# EAGLE design GBC USB-C Charging Kit (EAGLE 6.2)
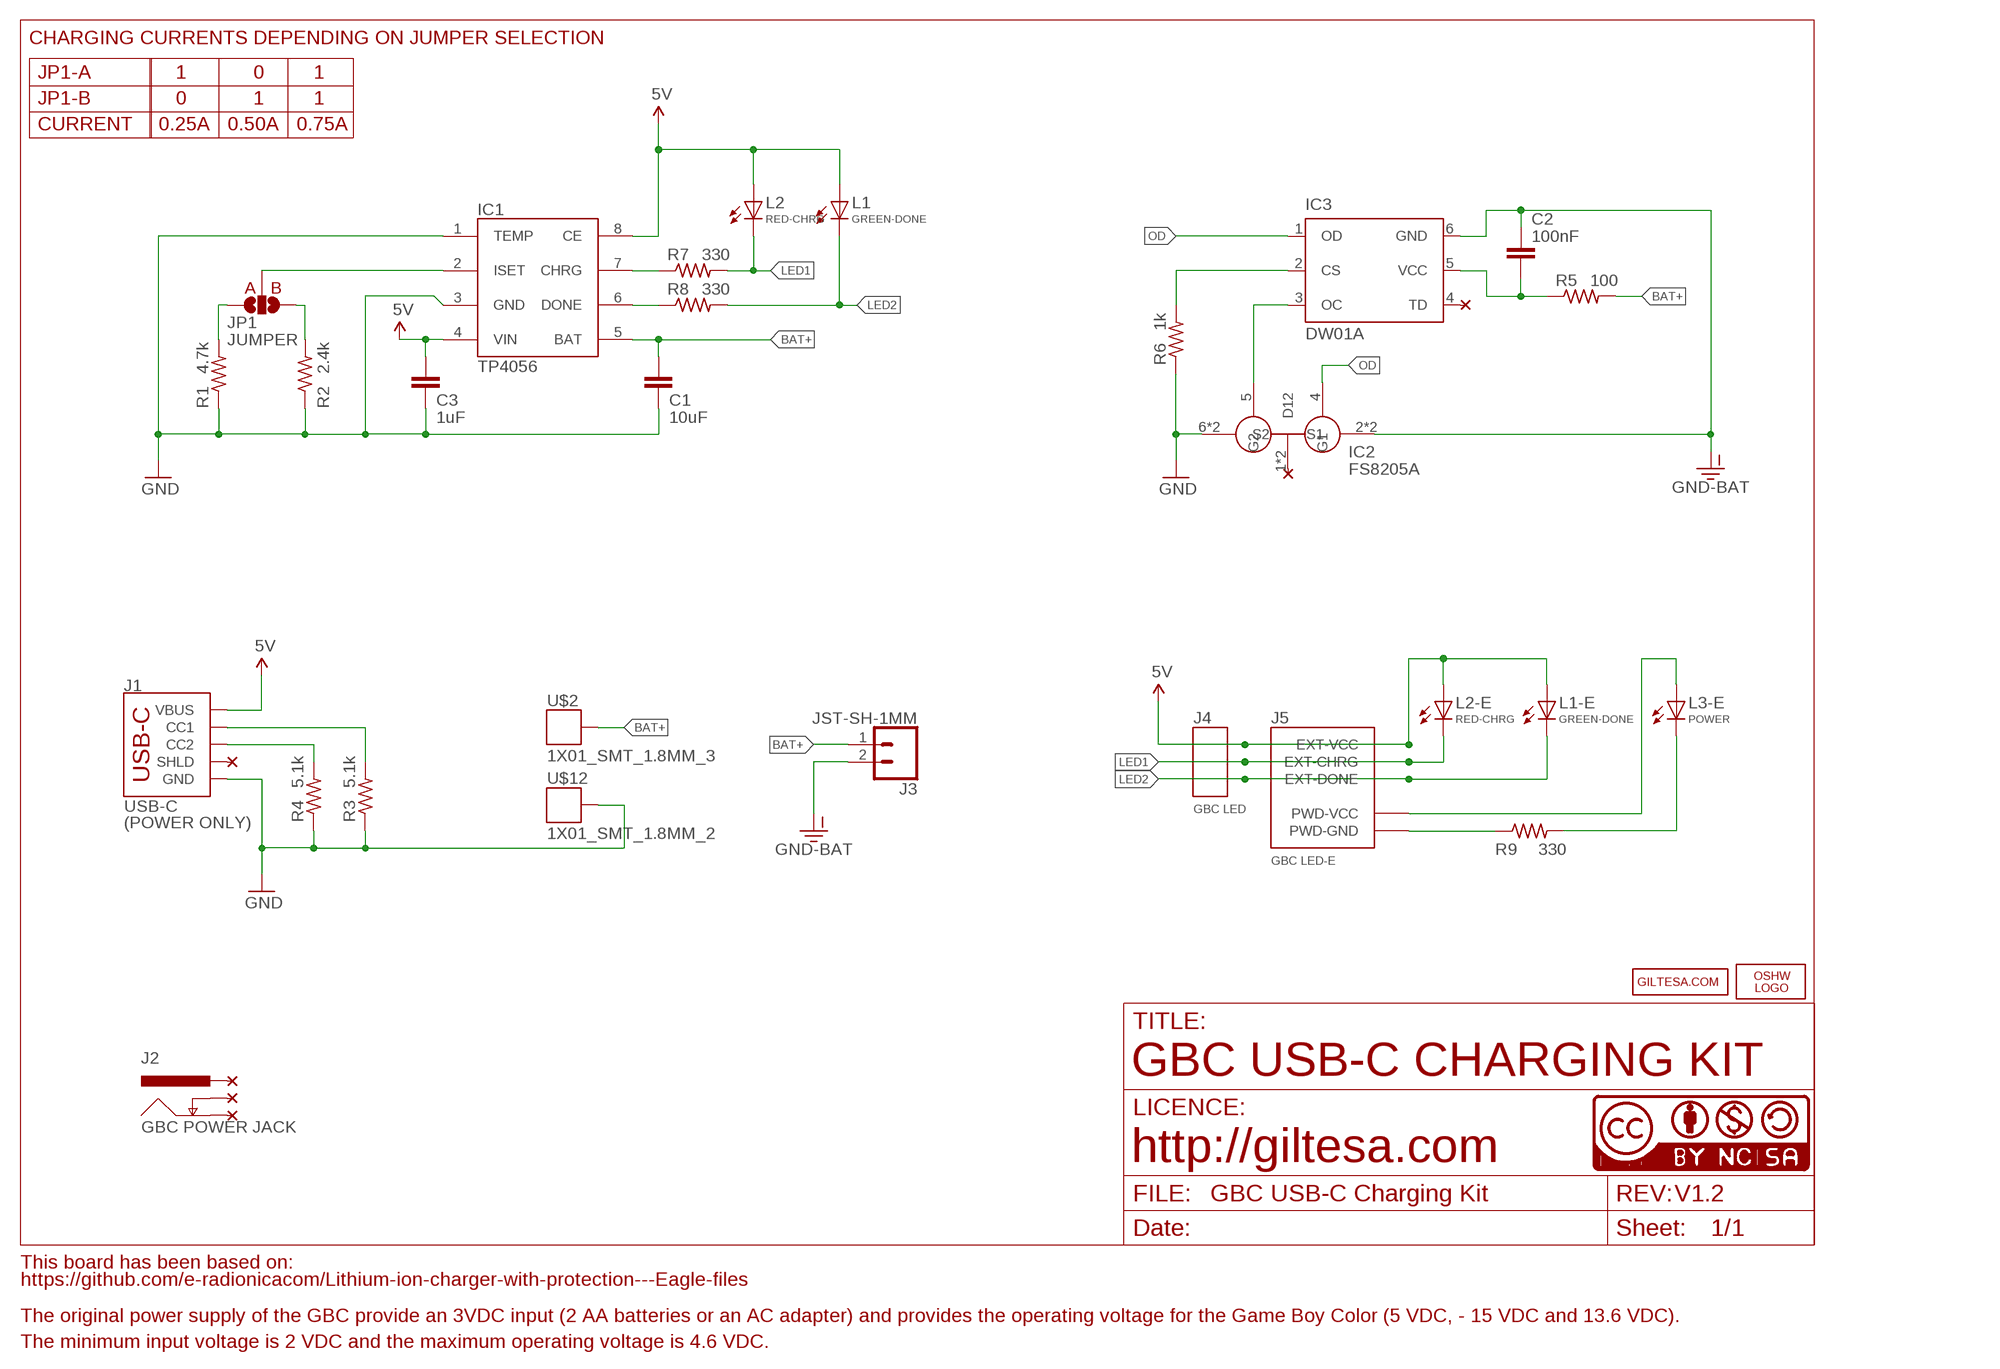
[diagram p0: schematic, sheet 1]

## Parts
C1  10uF  C1206  [C1206]
C2  100nF  C0603  [C0603]
C3  1uF  C0603  [C0603]
IC1  TP4056  DIO5158  [SOIC-8]
IC2  8205A  FS8205A  [TSSOP8]
IC3  DW01A  DW01-P  [SOT23-6L]
J1  USB-C  USB-CPOWER  [USB-C_6P]
J2  GBC POWER JACK  GBC_POWER_JACK2  [GBC_POWER_JACK_2]
J3  JST-SH-1MM  JST-21MM  [JST-2-1MM-SMD_RIGHT]
J4  GBC LED  1X032  [1X03_SMD_2]
J5  GBC LED-E  GBC_LED  [GBC_LED]
JP1  JUMPER  JUMPER-SMT_3_NO_SILK  [SMT-JUMPER_3_NO_SILK]
L1  GREEN-DONE  L0402  [L0402]
L1-E  GREEN-DONE  L0402  [L0402]
L2  RED-CHRG  L0402  [L0402]
L2-E  RED-CHRG  L0402  [L0402]
L3-E  POWER  L0402  [L0402]
LOGO1  OSHW_LOGO_FILLX0150-NT  [OSHW_FILLX150_NOTEXT]
R1  4.7k  R0402  [R0402]
R2  2.4k  R0402  [R0402]
R3  5.1k  R0402  [R0402]
R4  5.1k  R0402  [R0402]
R5  100  R0402  [R0402]
R6  1k  R0402  [R0402]
R7  330  R0402  [R0402]
R8  330  R0402  [R0402]
R9  330  R0402  [R0402]
U$2  1X01_SMT_1.8MM_3  [1X01_SMT_1.8MM_3]
U$10  GILTESA.COM_MASK  [GILTESA.COM_MASK]
U$12  1X01_SMT_1.8MM_2  [1X01_SMT_1.8MM_2]
U$17  CC-NC-BCNIX  [CC-NC-B_NIX]

## Nets
5V: C3.1 IC1.4(VIN) IC1.8(CE) J1.VBUS1(VBUS) J1.VBUS2(VBUS) J4.3 J5.EXT-VCC L1-E.A L1.A L2-E.A L2.A
BAT+: C1.1 IC1.5(BAT) J3.1 R5.2 U$2.P$1
CHRG: IC1.7(CHRG) R7.1
DONE: IC1.6(DONE) R8.1
GND: C1.2 C3.2 IC1.1(TEMP) IC1.3(GND) IC2.6(S2) IC2.7(S2) J1.GND1(GND) J1.GND2(GND) R1.1 R2.1 R3.1 R4.1 R6.1 U$12.P$1
GND-BAT: C2.1 IC2.2(S1) IC2.3(S1) IC3.6(GND) J3.2
ISET: IC1.2(ISET) JP1.2
LED1: J4.2 J5.EXT-CHRG L2-E.C L2.C R7.2
LED2: J4.1 J5.EXT-DONE L1-E.C L1.C R8.2
N$1: IC3.2(CS) R6.2
N$2: IC2.5(G2) IC3.3(OC)
N$4: J1.B5(CC2) R4.2
N$8: JP1.3 R2.2
N$9: JP1.1 R1.2
N$10: J5.PWD-VCC L3-E.A
N$11: L3-E.C R9.2
N$12: J5.PWD-GND R9.1
N$13: J1.A5(CC1) R3.2
OD: IC2.4(G1) IC3.1(OD)
VCC-DW: C2.2 IC3.5(VCC) R5.1
Unconnected: IC2.1(D12) IC2.8(D12) IC3.4(TD) J1.SHLD1(SHLD) J1.SHLD2(SHLD) J1.SHLD3(SHLD) J1.SHLD4(SHLD) J1.SHLD5(SHLD) J1.SHLD6(SHLD) J1.SHLD7(SHLD) J1.SHLD8(SHLD) J2.P$1(PWR) J2.P$2(GND) J2.P$3(GNDBREAK)

## Notes on the sheet
- CHARGING CURRENTS DEPENDING ON JUMPER SELECTION
- JP1-A | 1 | 0 | 1
- JP1-B | 0 | 1 | 1
- CURRENT | 0.25A | 0.50A | 0.75A
- A | B
- IC2
- FS8205A
- (POWER ONLY)
- GBC USB-C CHARGING KIT
- http://giltesa.com
- V1.2
- This board has been based on:
- https://github.com/e-radionicacom/Lithium-ion-charger-with-protection---Eagle-files
- The original power supply of the GBC provide an 3VDC input (2 AA batteries or an AC adapter) and provides the operating voltage for the Game Boy Color (5 VDC, - 15 VDC and 13.6 VDC).
- The minimum input voltage is 2 VDC and the maximum operating voltage is 4.6 VDC.

## Library data of the parts
C1 = ,giltesa:C1206
C2 C3 = ,giltesa:C0603
IC1 = ERADIONICA:DIO5158
IC2 = SparkFun:FS8205A
IC3 = lipo:DW01-P: One Cell Lithium-ion/Polymer Battery Protection IC The DW01-P battery protection IC is designed to protect lithium-ion/polymer battery from damage or degrading the lifetime due to overcharge, overdischarge, and/or overcurrent for one-cell lithium-ion/polymer battery powered systems, such as cellular phones. The ultra-small package and less required external components make it ideal to integrate the DW01-P into the limited space of battery pack. The accurate ±50mV overcharging detection voltage ensures safe and full utilization charging. The very low standby current drains little current from the cell while in storage.
J1 = ,giltesa:USB-C
J2 = ,giltesa:GBC_POWER_JACK
J3 = ,giltesa:JST-2
J4 = ,giltesa:1X03
J5 = ,giltesa:GBC_LED
JP1 = SparkFun-Jumpers:JUMPER-SMT_3_NO: Normally open jumper This jumper has three pads in close proximity to each other. Apply solder to close the connection(s).
L1 L1-E L2 L2-E L3-E = ,giltesa:L0402
LOGO1 = ohw-logo:OSHW_LOGO_FILL
R1-R9 = ,giltesa:R0402
U$2 U$12 = ,giltesa:1X01
U$10 = ,giltesa_logos:GILTESA.COM
U$17 = cc-by-nc-sa:CC-NC-BC: All hardware is licensed under the Creative Commons Attribution-Noncommercial-Share Alike 2.5 Switzerland License. To view a copy of this license, visit http://creativecommons.org/licenses/by-nc-sa/2.5/ch/ or send a letter to Creative Commons, 171 Second Street, Suite 300, San Francisco, California, 94105, USA.

## Net classes
1 power: width 0.61 mm, drill 0.406 mm, clearance 0.203 mm
2 gnd: width 0.305 mm, drill 0.406 mm, clearance 0.203 mm
3 power usb: width 0.508 mm, drill 0.406 mm, clearance 0.203 mm

## Board
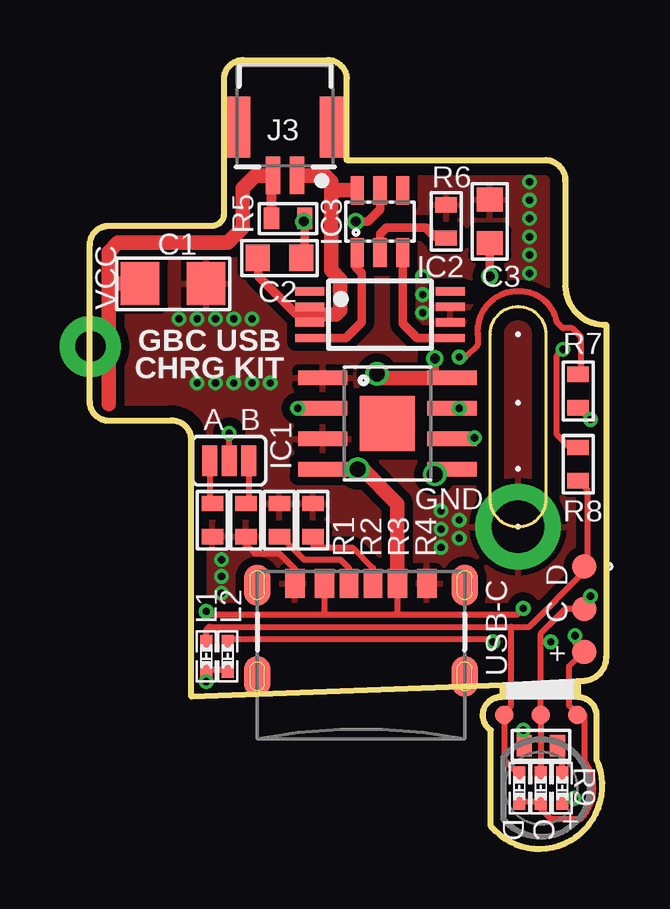
[diagram p1: board, top side]
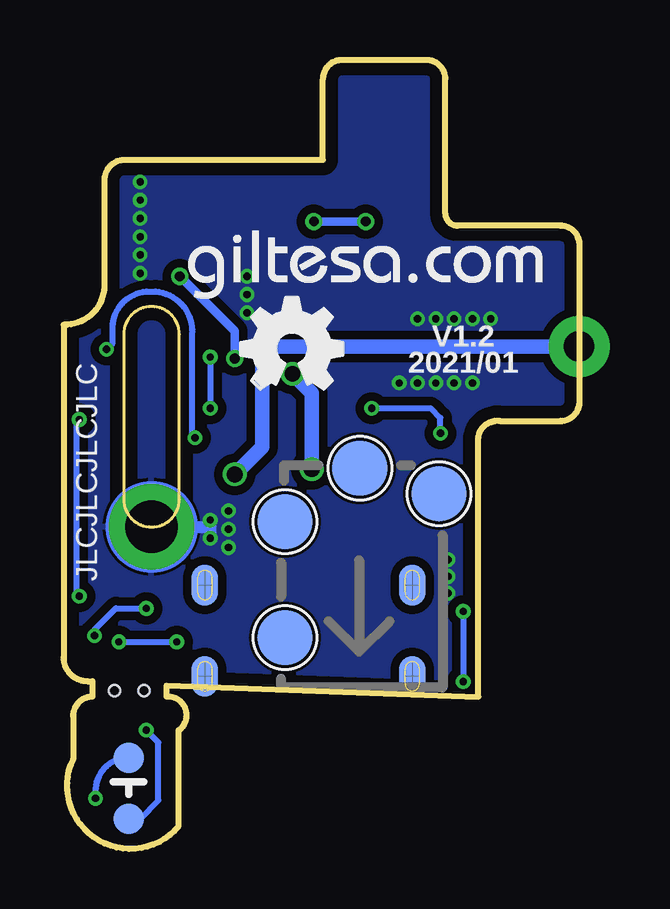
[diagram p2: board, bottom side, seen from below]

Size 21.51 x 32.89 mm. Coordinates in mm from the lower left corner, seen from the top.
Outline: 19,21.45 19,14.57 arc-180 16.69,14.57 16.69,21.45 arc-180 19,21.45
Outline: 4.23,6.34 4.23,17.14 arc90 3.33,17.84 0.8,17.84 arc-90 0,18.64 0,25.17 arc-90 0.8,25.97 5.09,25.97 arc90 5.59,26.47 5.59,32.09 arc-90 6.39,32.89 9.9,32.89 arc-90 10.71,32.09 10.71,28.72 19.01,28.72 arc-90 19.81,27.82 19.81,23.45 arc90 21.51,21.85 21.51,7.99 arc-90 20.51,6.99 20.31,6.99 20.31,6.34 arc-90 21.11,5.54 21.11,3.74 arc-165 16.71,0.94 16.71,4.94 arc-149 17.21,6.34 17.21,6.81 4.23,6.34
Copper layers (1*16): Top 0.035mm / dielectric 1.6mm / Bottom 0.035mm
Design rules: minimum track width 6mil, minimum drill 12mil, track to track 6mil, track to pad 6mil, pad to pad 6mil, via to via 8mil, smd to smd 0mil, copper to edge 20mil, drill to drill 10mil, minimum pad ring 6mil, minimum via ring 6mil, stop-mask expansion 0mil, vias tented up to drill 100mil, thermal gap 10mil
Holes 0.46 mm at 18.16,6.59 19.38,6.59

### Footprints (pad centres in the part's own frame; a part is rotated, then mirrored left to right if it is on the bottom)
C1206 = smd 1.6 x 1.8: 1 -1.362,0; 2 1.387,0
C0603 = smd 1 x 1.1: 1 -0.901,0; 2 0.901,0
SOIC-8 = smd 0.61 x 2.057: 1 -2.07,-2.892; 2 -0.8,-2.892; 3 0.47,-2.892; 4 1.74,-2.892; 5 1.74,2.492; 6 0.47,2.492; 7 -0.8,2.492; 8 -2.07,2.492 | smd 2.286 x 2.286: EPAD -0.165,-0.2
TSSOP8 = smd 1.2 x 0.35: 1 -2.925,0.975; 2 -2.925,0.325; 3 -2.925,-0.325; 4 -2.925,-0.975; 5 2.925,-0.975; 6 2.925,-0.325; 7 2.925,0.325; 8 2.925,0.975
SOT23-6L = smd 0.55 x 1.2: 1 -0.95,-1.3; 2 0,-1.3; 3 0.95,-1.3; 4 0.95,1.3; 5 0,1.3; 6 -0.95,1.3
USB-C_6P = smd 0.76 x 1.2: A5 -0.5,-0.08; B5 0.5,-0.08 | smd 0.8 x 1.2: GND1 -2.75,-0.08; GND2 2.75,-0.08; VBUS1 -1.52,-0.08; VBUS2 1.52,-0.08 | smd 1.1 x 1.7: SHLD1 -4.32,-0.15; SHLD2 4.32,-0.15; SHLD5 -4.32,-3.95; SHLD8 4.32,-3.95 | smd 1.1 x 1.7 bottom: SHLD3 -4.32,-0.15; SHLD4 4.32,-0.15; SHLD6 -4.32,-3.95; SHLD7 4.32,-3.95
GBC_POWER_JACK_2 = smd 2.286 x 2.286 bottom: P$1 5.232,10.16; P$2 8.357,7.925; P$3 1.93,9.093; P$4 8.357,3.099
JST-2-1MM-SMD_RIGHT = smd 0.6 x 1.55: 1 -0.5,-2.017; 2 0.5,-2.017 | smd 1.219 x 2.54: NC1 -2.054,0; NC2 2.054,0
1X03_SMD_2 = smd 1.016 x 1.016: 1 0,-1.778; 2 0,0; 3 0,1.778
GBC_LED = smd 0.762 x 0.762: EXT-CHRG -3.048,0; EXT-DONE -3.048,-1.524; EXT-VCC -3.048,1.524 | smd 1.27 x 1.27 bottom: PWD-GND 1.27,0; PWD-VCC -1.27,0
SMT-JUMPER_3_NO_SILK = smd 0.635 x 1.27: 1 -0.813,0; 2 0,0; 3 0.813,0
L0402 = smd 0.7 x 0.5: A -0.55,0; C 0.55,0
R0402 = smd 0.635 x 0.9: 1 -0.694,0; 2 0.694,0
1X01_SMT_1.8MM_3 = drill 1.27 pad 2.54: P$1 0,0
1X01_SMT_1.8MM_2 = drill 2.184 pad 3.556: P$1 0,0

### Placement (x,y rotation side)
C1  3.46,23.56 0 top
C2  7.91,24.63 0 top
C3  16.66,26.15 90 top
IC1  12.6,17.56 270 top
IC2  12.09,22.27 0 top
IC3  12.09,26.15 0 top
J1  11.3,11.14 0 top
J2  3.93,5.7 0 top
J3  8.14,30.09 0 top
J4  20.6,9.99 180 top
J5  18.79,2.53 270 top
JP1  5.81,16.18 0 top
L1  4.85,8.02 90 top
L1-E  17.9,2.53 90 top
L2  5.74,8.02 90 top
L2-E  18.79,2.53 90 top
L3-E  19.68,2.53 90 top
LOGO1  14.12,19.17 0 bottom
R1  5.11,13.71 90 top
R2  6.5,13.71 90 top
R3  7.9,13.71 270 top
R4  9.3,13.71 270 top
R5  8.27,26.28 180 top
R6  14.84,26.15 270 top
R7  20.35,19.08 270 top
R8  20.35,16.04 270 top
R9  18.79,4.31 0 top
U$2  0.03,20.94 0 top
U$10  16.41,22.85 0 bottom
U$12  17.85,13.43 0 top
U$17  0.41,6.34 0 top

### Tracks (layer width: path | path; a pad name or v marks a point on that pad's centre or on a via)
5V  (via drill 0.3, 0.41, 0.66)
  Top 0.254: L1-E.A L2-E.A 18.79,1.67 19.2,1.26 20.47,1.26 arc80 20.6,3.67 20.6,5.58 20.47,5.45 J5.EXT-VCC 20.32,5.61 19.97,5.96 19.97,7.61 20.57,8.21 J4.3 20.22,8.59 v20.22,8.88 | L2.A L1.A v4.85,6.97 | v4.85,9.9 4.98,9.77 9.81,9.77 | 9.81,9.77 12.73,9.77 | 12.73,9.77 17.81,9.77 v18.06,10.02 | J1.VBUS1 9.78,9.8 9.81,9.77 | J1.VBUS2 12.82,9.86 12.73,9.77
  Top 0.356: 14.8,19.63 14.38,19.67 v14.38,20.44 | v16.66,23.87 C3.1
  Top 0.61: IC1.4 v11.16,15.82 11.37,15.82 12.82,14.38 J1.VBUS2 | IC1.8 14.8,19.63 12.13,19.63 v11.96,19.8
  Bottom 0.254: v20.22,8.88 20.22,9.13 19.33,10.02 v18.06,10.02 | v4.85,9.9 v4.85,6.97
  Bottom 0.356: v14.38,20.44 14.38,21.58 v16.66,23.87
  Bottom 0.61: v11.16,15.82 11.16,19 v11.96,19.8
BAT+  (via drill 0.66)
  Top 0.406: R5.2 7.57,28 J3.1
  Top 0.61: 0.79,23.61 0.79,24.88 1.17,25.26 5.74,25.26 6.38,25.9 6.38,27.55 6.9,28.07 J3.1 | C1.1 0.84,23.56 0.79,23.61 | IC1.5 14.59,15.82 v14.38,15.61 | 0.79,23.61 0.79,20.18 | 0.79,18.53 0.79,20.18 | 0.79,20.18 U$2.P$1
  Bottom 0.61: U$2.P$1 12.85,20.94 13.23,20.56 13.23,16.75 v14.38,15.61
CHRG  (via drill 0.3)
  Top 0.254: R7.1 20.47,19.78 20.47,21.33 20.09,21.71 19.71,21.71 19.46,21.96 arc75 18.06,23.23 17.68,23.23 arc90 16.16,21.45 16.16,21.01 15.65,20.5 v15.39,20.5 | v15.39,18.37 15.39,18.31 IC1.7
  Bottom 0.254: v15.39,20.5 v15.39,18.37
DONE  (via drill 0.3)
  Top 0.254: R8.1 19.99,16.73 19.46,17.26 19.46,20.56 v19.71,20.82 | IC1.6 15.99,17.09 v16.03,17.13
  Bottom 0.254: v19.71,20.82 19.46,21.07 19.46,21.58 arc90 18.06,23.23 17.68,23.23 arc90 16.16,21.45 16.16,17.26 v16.03,17.13
GND  (via drill 0.3)
  Top 0.254: R2.1 6.5,12.69 6.89,12.31 7.9,12.31 8.55,11.66 J1.GND1
  Bottom 0.508: 17.81,13.43 15.39,13.43 v15.39,12.94
  Bottom 3.81: U$12.P$1 17.81,13.43
  other vias: 5.49,12.05 5.49,11.36 5.49,10.66 15.39,13.71 14.63,13.32 14.63,14.09 14.63,12.56 13.87,23.87 13.87,23.1 13.87,22.34 3.71,22.09 4.47,22.09 5.23,22.09 6,22.09 6.76,22.09 7.52,19.42 6.76,19.42 6,19.42 5.23,19.42 4.47,19.42 18.32,25.52 18.32,27.8 18.32,27.04 18.32,24.75 18.32,26.28 18.32,23.99
  pour Top (isolate 0.356): -0.61,33.64 22.25,33.64 22.25,5.7 -0.61,5.7
  pour Bottom (isolate 0.356): -0.61,33.64 22.25,33.64 22.25,5.7 -0.61,5.7
GND-BAT
  Top 0.305: IC2.3 9.17,22.27 | IC2.2 9.17,22.27 | 9.17,22.27 8.97,22.27
  Top 0.356: 8.97,22.27 8.61,22.27 7.01,23.87 C2.1
  Top 0.508: IC3.6 10.98,27.45
  Top 0.61: 9.17,22.27 10.24,22.27 10.44,22.47 10.44,23.74 10.06,24.12 10.06,27.55 | 10.06,27.55 10.06,27.8 9.81,28.06 8.65,28.06 J3.2 | 10.98,27.45 10.16,27.45 10.06,27.55
ISET  (via drill 0.3)
  Top 0.254: JP1.2 v5.81,17.33 | v8.66,18.37 9.62,18.28 IC1.2
  Bottom 0.254: v8.66,18.37 6.21,18.37 5.81,17.96 v5.81,17.33
LED1  (via drill 0.3)
  Top 0.254: L2-E.C J5.EXT-CHRG 18.79,8.63 | 18.79,8.63 18.79,8.97 19.81,9.99 J4.2 20.6,10.02 20.86,10.28 v20.86,10.53 | v20.86,17.9 20.84,17.9 R7.2 | 5.74,8.63 L2.C 5.79,8.63 5.79,8.68 5.87,8.75 16.66,8.75 v16.79,8.63 | v19.2,8.63 18.79,8.63
  Bottom 0.254: v20.86,17.9 20.98,17.77 20.98,10.66 v20.86,10.53 | v19.2,8.63 v16.79,8.63
LED2
  Top 0.254: L1-E.C 17.27,3.71 J5.EXT-DONE 17.27,5.67 17.55,5.96 17.55,9.26 | 20.35,12.02 J4.1 | J4.1 20.57,11.51 18.32,9.26 17.55,9.26 | L1.C 4.85,9.13 4.98,9.26 17.55,9.26 | R8.2 20.36,15.34 20.73,14.98 20.73,11.9 J4.1
N$1
  Top 0.356: IC3.2 12.09,25.64 12.35,25.9 14,25.9 14.38,25.52 14.78,25.52 R6.2
N$2
  Top 0.356: IC3.3 13.04,21.9 13.65,21.29 IC2.5
N$4
  Top 0.254: R4.2 9.3,12.69 9.42,12.56 10.95,12.56 11.8,11.72 J1.B5
N$8
  Top 0.254: JP1.3 6.62,14.51 R2.2
N$9
  Top 0.254: JP1.1 4.99,14.51 R1.2
N$10  (via drill 0.3)
  Top 0.254: L3-E.A arc-90 19.81,2.11 v20.18,2.11
  Bottom 0.254: J5.PWD-VCC arc-90 20.18,2.41 v20.18,2.11
N$11
  Top 0.254: L3-E.C 19.68,4.11 R9.2
N$12  (via drill 0.3)
  Top 0.254: v18.06,4.94 18.06,4.34 R9.1
  Bottom 0.254: v18.06,4.94 17.55,4.43 17.55,2.02 18.32,1.26 J5.PWD-GND
N$13
  Top 0.254: R3.2 7.96,13.01 8.92,12.05 10.44,12.05 10.8,11.7 J1.A5
OD
  Top 0.356: IC2.4 10.66,21.29 11.33,21.96 11.33,23.99 11.08,24.25 11.08,24.79 IC3.1
VCC-DW  (via drill 0.41)
  Top 0.356: C2.2 8.96,24.78 R5.1 v8.92,26.15 | v11.08,26.15 11.58,26.15 12.09,26.66 IC3.5
  Bottom 0.356: v8.92,26.15 v11.08,26.15

### Text on the board
tPlace: VCC | GBC USB | CHRG KIT | A | B | GND | D | C | + | D | C | +
bPlace: V1.2 | 2021/01 | JLCJLCJLCJLC